# EasyEDA schematic SCH_Just-random_2026-04-02.json
TITLE: Sheet_1; REV: 1.0; Date: 2026-04-02; Sheet: 1/1; Drawn By: camhen2749; Company: Your Company
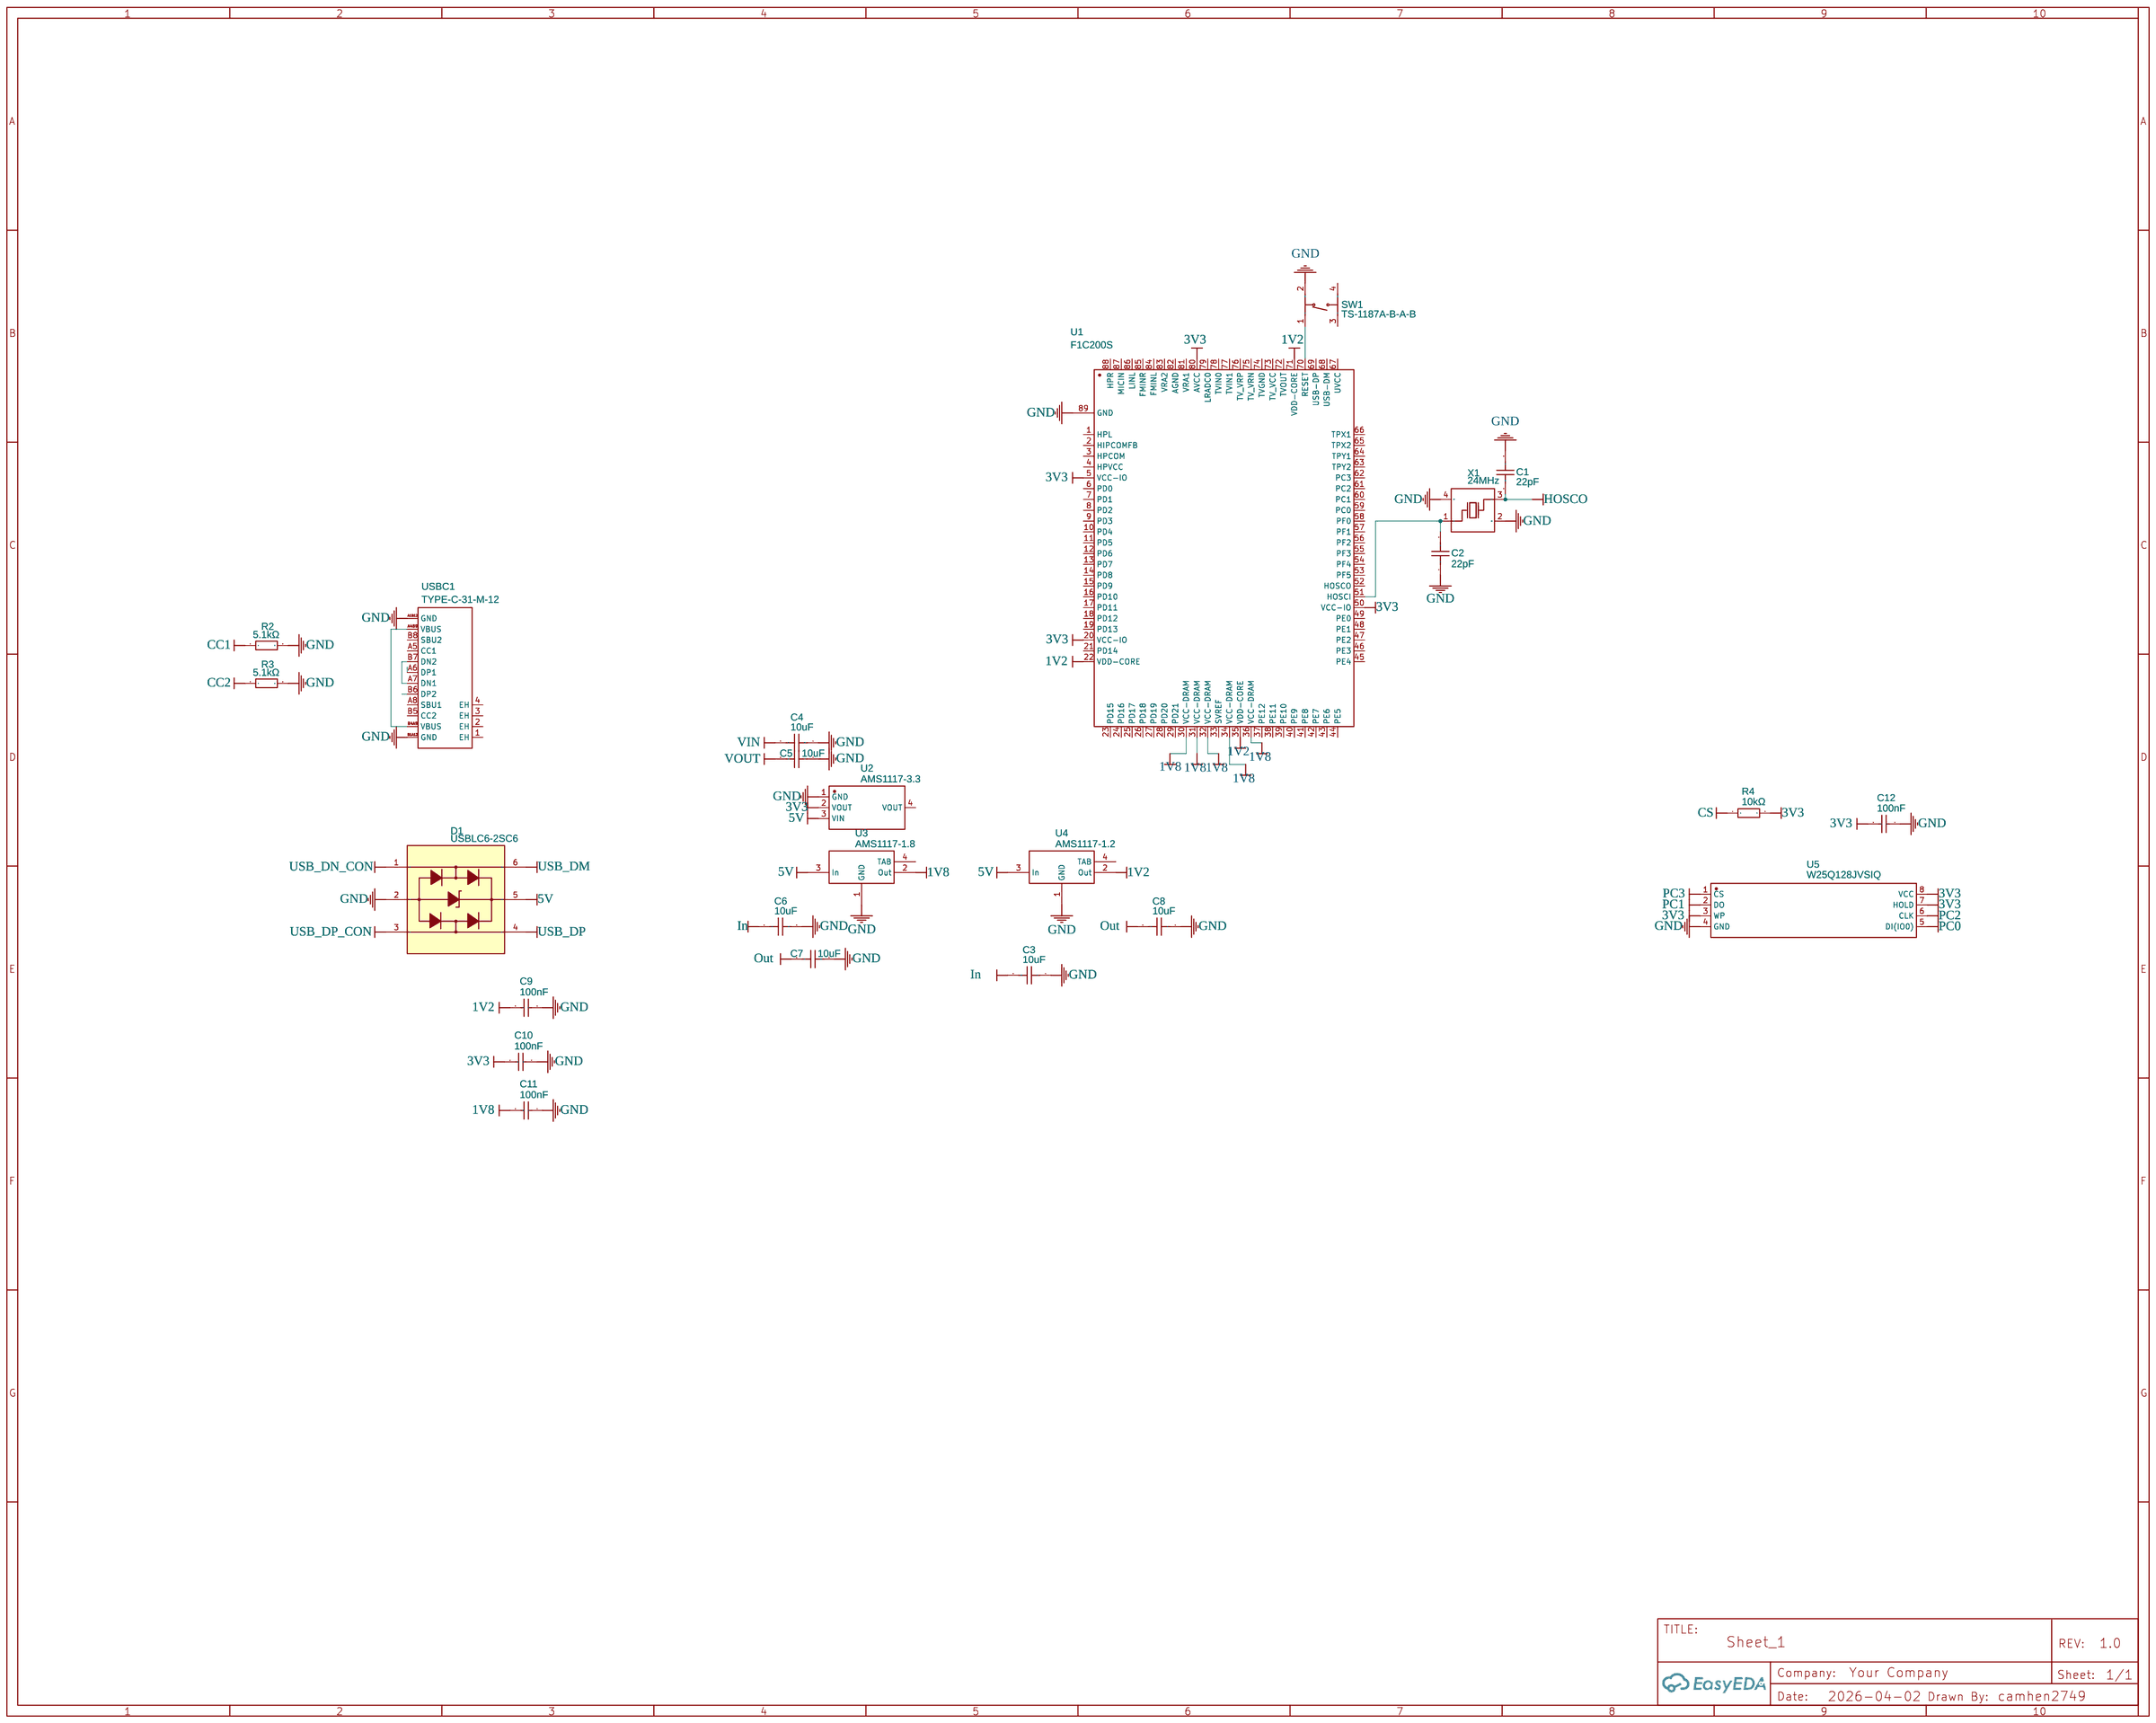
[diagram p0: schematic sheet]

## Parts
C1  22pF  [C0603]
C2  22pF  [C0603]
C3  10uF  [C0603]
C4  10uF  [C0603]
C5  10uF  [C0603]
C6  10uF  [C0603]
C7  10uF  [C0603]
C8  10uF  [C0603]
C9  100nF  [C0402]
C10  100nF  [C0402]
C11  100nF  [C0402]
C12  100nF  [C0402]
D1  USBLC6-2SC6  [SOT-23-6_L2.9-W1.6-P0.95-LS2.8-BL]
R2  5.1kΩ  [R0402]
R3  5.1kΩ  [R0402]
R4  10kΩ  [R0402]
SW1  TS-1187A-B-A-B  [SW-SMD_4P-L5.1-W5.1-P3.70-LS6.5-TL_H1.5]
U1  F1C200S  [QFN-88_L10.0-W10.0-P0.40-BL-EP6.75]
U2  AMS1117-3.3  [SOT-223-3_L6.5-W3.4-P2.30-LS7.0-BR]
U3  AMS1117-1.8  [SOT-223-4_L6.5-W3.5-P2.30-LS7.0-BR]
U4  AMS1117-1.2  [SOT-223-4_L6.5-W3.5-P2.30-LS7.0-BR]
U5  W25Q128JVSIQ  [SOIC-8_L5.3-W5.3-P1.27-LS8.0-BL]
USBC1  TYPE-C-31-M-12  [USB-C_SMD-TYPE-C-31-M-12_1]
X1  24MHz  [CRYSTAL-SMD_4P-L3.2-W2.5-BL]

## Library data of the parts
C1 C2 = C1608CH2A220J080AA: Contributor: lcsc; Supplier: LCSC; Supplier Part: C3844576; Manufacturer: TDK; JLCPCB Part Class: Extended Part
C3-C8 = CC0603KRX5R6BB106: Contributor: LCSC; Supplier: LCSC; Supplier Part: C326057; Manufacturer: YAGEO(国巨); JLCPCB Part Class: Extended Part
C9-C12 = CC0402KRX7R9BB104: Contributor: LCSC; Supplier: LCSC; Supplier Part: C131394; Manufacturer: YAGEO(国巨); JLCPCB Part Class: Extended Part
D1 = USBLC6-2SC6: Supplier: LCSC; Manufacturer: ST(意法半导体); Supplier Part: C7519; JLCPCB Part Class: Extended Part
R2 R3 = RC0402FR-075K1L: Supplier: LCSC; Manufacturer: YAGEO(国巨); Supplier Part: C105872; JLCPCB Part Class: Extended Part
R4 = RC0402FR-0710KL: Supplier: LCSC; Manufacturer: YAGEO(国巨); Supplier Part: C60490; JLCPCB Part Class: Extended Part
SW1 = TS-1187A-B-A-B: Contributor: LCSC; Supplier: LCSC; Supplier Part: C318884; Manufacturer: XKB Connection(中国星坤); JLCPCB Part Class: Basic Part
U1 = F1C200S: Contributor: LCSC; Supplier: LCSC; Supplier Part: C2879851; Manufacturer: Allwinner(全志); JLCPCB Part Class: Extended Part
U2 = AMS1117-3.3: sourceId: dwIGgezVh; Supplier: LCSC; Manufacturer: AMS; Supplier Part: C6186; JLCPCB Part Class: Basic Part
U3 = AMS1117-1.8: Supplier: LCSC; Manufacturer: AMS; Supplier Part: C6185; JLCPCB Part Class: Extended Part
U4 = AMS1117-1.2: Supplier: LCSC; Manufacturer: AMS; Supplier Part: C14529; JLCPCB Part Class: Extended Part
U5 = W25Q128JVSIQ: Contributor: LCSC; Supplier: LCSC; Supplier Part: C113767; Manufacturer: Winbond(华邦); JLCPCB Part Class: Extended Part
USBC1 = TYPE-C-31-M-12: Contributor: LCSC; Supplier: LCSC; Supplier Part: C165948; Manufacturer: 韩国韩荣; JLCPCB Part Class: Extended Part
X1 = X322524MSB4SI: Supplier: LCSC; Manufacturer: YXC(扬兴晶振); Supplier Part: C15643; JLCPCB Part Class: Extended Part

## Nets
1V2: C9.1 U1.22(VDD-CORE) U1.35(VDD-CORE) U1.71(VDD-CORE) U4.2(Out)
1V8: C11.1 U1.30(VCC-DRAM) U1.31(VCC-DRAM) U1.32(VCC-DRAM) U1.34(VCC-DRAM) U1.36(VCC-DRAM) U3.2(Out)
3V3: C10.1 C12.1 R4.2 U1.5(VCC-IO) U1.20(VCC-IO) U1.50(VCC-IO) U1.80(AVCC) U2.2(VOUT) U5.3(WP) U5.7(HOLD) U5.8(VCC)
5V: D1.5 U2.3(VIN) U3.3(In) U4.3(In)
GND: C1.2 C2.1 C3.1 C4.1 C5.1 C6.1 C7.1 C8.1 C9.2 C10.2 C11.2 C12.2 D1.2 R2.2 R3.2 SW1.2(B) U1.89(GND) U2.1(GND) U3.1(GND) U4.1(GND) U5.4(GND) USBC1.A1B12(GND) USBC1.B1A12(GND) X1.2(GND) X1.4(GND)
VIN: C4.2
CC1: R2.1
CC2: R3.1
CS: R4.1
HOSCO: C1.1 X1.3(OSC2)
In: C3.2 C6.2
Out: C7.2 C8.2
PC0: U5.5(DI(IO0))
PC1: U5.2(DO)
PC2: U5.6(CLK)
PC3: U5.1(CS)
USB_DM: D1.6
USB_DN_CON: D1.1
USB_DP: D1.4
USB_DP_CON: D1.3
VOUT: C5.2
Net-(C2-2): C2.2 U1.51(HOSCI) X1.1(OSC1)
Net-(SW1-1): SW1.1(A) U1.70(RESET)
Net-(USBC1-A4B9): USBC1.A4B9(VBUS) USBC1.B4A9(VBUS)
Net-(USBC1-A7): USBC1.A7(DN1) USBC1.B7(DN2)

Not connected (* = marked no-connect by the designer): SW1 3(C) 4(D); U1 1(HPL) 2(HIPCOMFB) 3(HPCOM) 4(HPVCC) 6(PD0) 7(PD1) 8(PD2) 9(PD3) 10(PD4) 11(PD5) 12(PD6) 13(PD7) 14(PD8) 15(PD9) 16(PD10) 17(PD11) 18(PD12) 19(PD13) 21(PD14) 23(PD15) 24(PD16) 25(PD17) 26(PD18) 27(PD19) 28(PD20) 29(PD21) 33(SVREF) 37(PE12) 38(PE11) 39(PE10) 40(PE9) 41(PE8) 42(PE7) 43(PE6) 44(PE5) 45(PE4) 46(PE3) 47(PE2) 48(PE1) 49(PE0) 52(HOSCO) 53(PF5) 54(PF4) 55(PF3) 56(PF2) 57(PF1) 58(PF0) 59(PC0) 60(PC1) 61(PC2) 62(PC3) 63(TPY2) 64(TPY1) 65(TPX2) 66(TPX1) 67(UVCC) 68(USB-DM) 69(USB-DP) 72(TVOUT) 73(TV_VCC) 74(TVGND) 75(TV_VRN) 76(TV_VRP) 77(TVIN1) 78(TVIN0) 79(LRADC0) 81(VRA1) 82(AGND) 83(VRA2) 84(FMINL) 85(FMINR) 86(LINL) 87(MICIN) 88(HPR); U2 4(VOUT); U3 4(TAB); U4 4(TAB); USBC1 1(EH) 2(EH) 3(EH) 4(EH) A5(CC1) A6(DP1) A8(SBU1) B5(CC2) B6(DP2) B8(SBU2)
